# Altium project template.PrjPcb (part 3 of 3)
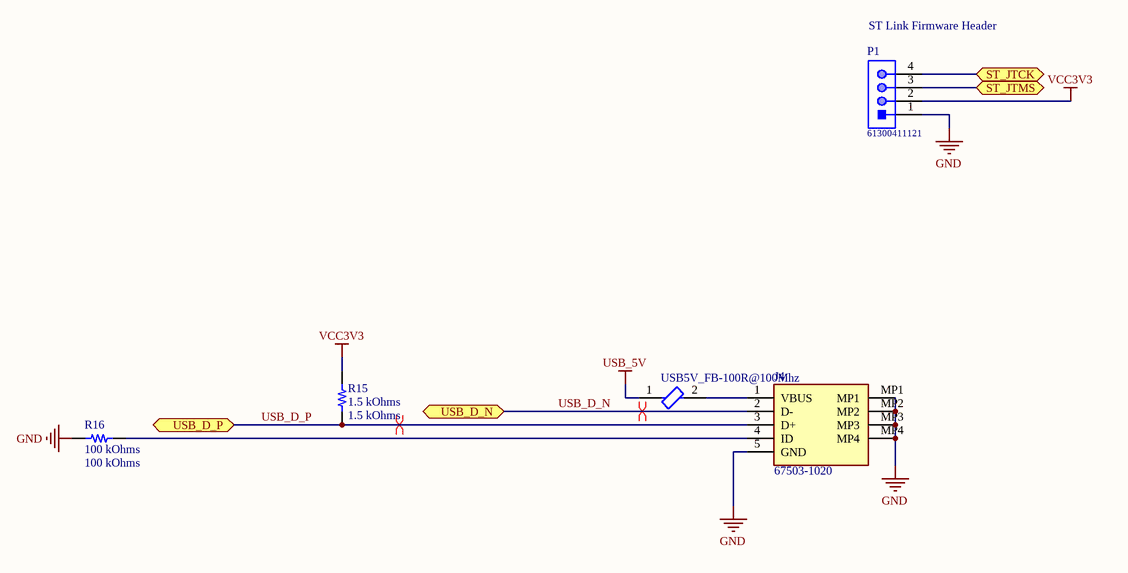
[diagram p19: DebuggerConnectors.SchDoc]

## Nets that join several sheets
GND: TOP (28 pins), STM32 (25 pins), Microcontroller/CAN1 (5 pins), Microcontroller/CAN2 (5 pins), 12V_POWER_BULKHEAD (6 pins), 12V Power And Ground/Shift Register (C9_12V_Power_And_Ground_Shift_Register.2 U2_12V_Power_And_Ground_Shift_Register.8 U2_12V_Power_And_Ground_Shift_Register.13), 12V Power And Ground/Designator (5 pins), 12V Power And Ground/Designator (5 pins), 12V Power And Ground/Designator (5 pins), 12V Power And Ground/Designator (5 pins), 12V Power And Ground/Designator (5 pins), 12V Power And Ground/Designator (5 pins), boardPower (8 pins), Buck (10 pins), LDO (5 pins), 12 Volt Signal Bulkhead/ (C3_6.1 R5_6.1), 12 Volt Signal Bulkhead/ (C3_5.1 R5_5.1), 12 Volt Signal Bulkhead/ (C3_4.1 R5_4.1), 12 Volt Signal Bulkhead/ (C3_3.1 R5_3.1), 12 Volt Signal Bulkhead/ (C3_2.1 R5_2.1), 12 Volt Signal Bulkhead/ (C3_1.1 R5_1.1), 5VBulkhead (6 pins), 5V Power And Ground/Shift Register (C9.2 U2.8 U2.13), 5V Power And Ground/5VLS1 (C7_5VLS1.1 C8_5VLS1.1 R13_5VLS1.1 U_5VLS1.4), 5V Power And Ground/5VLS2 (C7_5VLS2.1 C8_5VLS2.1 R13_5VLS2.1 U_5VLS2.4), 5V Power And Ground/5VLS3 (C7_5VLS3.1 C8_5VLS3.1 R13_5VLS3.1 U_5VLS3.4), 5V Power And Ground/5VLS4 (C7_5VLS4.1 C8_5VLS4.1 R13_5VLS4.1 U_5VLS4.4), 5V Power And Ground/5VLS5 (C7_5VLS5.1 C8_5VLS5.1 R13_5VLS5.1 U_5VLS5.4), 5V Power And Ground/5VLS6 (C7_5VLS6.1 C8_5VLS6.1 R13_5VLS6.1 U_5VLS6.4), Motor Controller 1 (DS1.2 DS2.2 P6_Motor_Controller_1.1), Motor Controller 1/Designator (5 pins), Motor Controller 2 (DS1_Motor_Controller_2.2 DS2_Motor_Controller_2.2 P6_Motor_Controller_2.1), Motor Controller 2/Designator (5 pins), Steering (DS1_Steering.2 DS2_Steering.2 P6_Steering.1), Steering/Designator (5 pins), DebuggerMCU (17 pins), DebuggerConnectors (7 pins)
VCC3V3: STM32 (18 pins), Microcontroller/CAN1 (C26_CAN1.2 U4_CAN1.5), Microcontroller/CAN2 (C26_CAN2.2 U4_CAN2.5), 12V Power And Ground/Designator (C6_12V_Power_And_Ground_Designator#1.2 R10_12V_Power_And_Ground_Designator#1.2 U1_12V_Power_And_Ground_Designator#1.3), 12V Power And Ground/Designator (C6_12V_Power_And_Ground_Designator#2.2 R10_12V_Power_And_Ground_Designator#2.2 U1_12V_Power_And_Ground_Designator#2.3), 12V Power And Ground/Designator (C6_12V_Power_And_Ground_Designator#3.2 R10_12V_Power_And_Ground_Designator#3.2 U1_12V_Power_And_Ground_Designator#3.3), 12V Power And Ground/Designator (C6_12V_Power_And_Ground_Designator#4.2 R10_12V_Power_And_Ground_Designator#4.2 U1_12V_Power_And_Ground_Designator#4.3), 12V Power And Ground/Designator (C6_12V_Power_And_Ground_Designator#5.2 R10_12V_Power_And_Ground_Designator#5.2 U1_12V_Power_And_Ground_Designator#5.3), 12V Power And Ground/Designator (C6_12V_Power_And_Ground_Designator#6.2 R10_12V_Power_And_Ground_Designator#6.2 U1_12V_Power_And_Ground_Designator#6.3), LDO (C20.2 C21.2 U5.2), 5V Power And Ground/5VLS1 (R12_5VLS1.2), 5V Power And Ground/5VLS2 (R12_5VLS2.2), 5V Power And Ground/5VLS3 (R12_5VLS3.2), 5V Power And Ground/5VLS4 (R12_5VLS4.2), 5V Power And Ground/5VLS5 (R12_5VLS5.2), 5V Power And Ground/5VLS6 (R12_5VLS6.2), Motor Controller 1/Designator (C6.2 R10.2 U1.3), Motor Controller 2/Designator (C6_Motor_Controller_2_Designator.2 R10_Motor_Controller_2_Designator.2 U1_Motor_Controller_2_Designator.3), Steering/Designator (C6_Steering_Designator.2 R10_Steering_Designator.2 U1_Steering_Designator.3), DebuggerMCU (6 pins), DebuggerConnectors (P1#2.2 R15#2.2)
VCC5V: Microcontroller/CAN1 (C38_CAN1.2 U4_CAN1.3), Microcontroller/CAN2 (C38_CAN2.2 U4_CAN2.3), 12V Power And Ground/Shift Register (C9_12V_Power_And_Ground_Shift_Register.1 U2_12V_Power_And_Ground_Shift_Register.10 U2_12V_Power_And_Ground_Shift_Register.16), boardPower (R34.2), Buck (5 pins), LDO (C18.2 C19.2 U5.3), 5V Power And Ground/Shift Register (C9.1 U2.10 U2.16), 5V Power And Ground/5VLS1 (C7_5VLS1.2 U_5VLS1.1 U_5VLS1.2), 5V Power And Ground/5VLS2 (C7_5VLS2.2 U_5VLS2.1 U_5VLS2.2), 5V Power And Ground/5VLS3 (C7_5VLS3.2 U_5VLS3.1 U_5VLS3.2), 5V Power And Ground/5VLS4 (C7_5VLS4.2 U_5VLS4.1 U_5VLS4.2), 5V Power And Ground/5VLS5 (C7_5VLS5.2 U_5VLS5.1 U_5VLS5.2), 5V Power And Ground/5VLS6 (C7_5VLS6.2 U_5VLS6.1 U_5VLS6.2)
VCC12V: 12V Power And Ground/Designator (C1_12V_Power_And_Ground_Designator#1.1 C4_12V_Power_And_Ground_Designator#1.1 U1_12V_Power_And_Ground_Designator#1.1 U1_12V_Power_And_Ground_Designator#1.9), 12V Power And Ground/Designator (C1_12V_Power_And_Ground_Designator#2.1 C4_12V_Power_And_Ground_Designator#2.1 U1_12V_Power_And_Ground_Designator#2.1 U1_12V_Power_And_Ground_Designator#2.9), 12V Power And Ground/Designator (C1_12V_Power_And_Ground_Designator#3.1 C4_12V_Power_And_Ground_Designator#3.1 U1_12V_Power_And_Ground_Designator#3.1 U1_12V_Power_And_Ground_Designator#3.9), 12V Power And Ground/Designator (C1_12V_Power_And_Ground_Designator#4.1 C4_12V_Power_And_Ground_Designator#4.1 U1_12V_Power_And_Ground_Designator#4.1 U1_12V_Power_And_Ground_Designator#4.9), 12V Power And Ground/Designator (C1_12V_Power_And_Ground_Designator#5.1 C4_12V_Power_And_Ground_Designator#5.1 U1_12V_Power_And_Ground_Designator#5.1 U1_12V_Power_And_Ground_Designator#5.9), 12V Power And Ground/Designator (C1_12V_Power_And_Ground_Designator#6.1 C4_12V_Power_And_Ground_Designator#6.1 U1_12V_Power_And_Ground_Designator#6.1 U1_12V_Power_And_Ground_Designator#6.9), boardPower (7 pins), Buck (6 pins), 5VBulkhead (R14.2), Motor Controller 1 (R7.2), Motor Controller 1/Designator (C1.1 C4_Motor_Controller_1_Designator.1 U1.1 U1.9), Motor Controller 2 (R7_Motor_Controller_2.2), Motor Controller 2/Designator (C1_Motor_Controller_2_Designator.1 C4_Motor_Controller_2_Designator.1 U1_Motor_Controller_2_Designator.1 U1_Motor_Controller_2_Designator.9), Steering (R7_Steering.2), Steering/Designator (C1_Steering_Designator.1 C4_Steering_Designator.1 U1_Steering_Designator.1 U1_Steering_Designator.9)
5V_CLOCK: STM32 (U6.1), 5V Power And Ground/Shift Register (U2.11)
5V_DATA: STM32 (U6.5), 5V Power And Ground/Shift Register (U2.14)
5V_FAULT: STM32 (U6.80), 5VBulkhead (R14.1), 5V Power And Ground/5VLS1 (U_5VLS1.8), 5V Power And Ground/5VLS2 (U_5VLS2.8), 5V Power And Ground/5VLS3 (U_5VLS3.8), 5V Power And Ground/5VLS4 (U_5VLS4.8), 5V Power And Ground/5VLS5 (U_5VLS5.8), 5V Power And Ground/5VLS6 (U_5VLS6.8)
5V_LATCH: STM32 (U6.3), 5V Power And Ground/Shift Register (U2.12)
12-3_1: STM32 (U6.15), 12 Volt Signal Bulkhead/ (C3_6.2 R4_6.1 R5_6.2)
12-3_2: STM32 (U6.16), 12 Volt Signal Bulkhead/ (C3_5.2 R4_5.1 R5_5.2)
12-3_3: STM32 (U6.36), 12 Volt Signal Bulkhead/ (C3_4.2 R4_4.1 R5_4.2)
12-3_4: STM32 (U6.18), 12 Volt Signal Bulkhead/ (C3_3.2 R4_3.1 R5_3.2)
12-3_5: STM32 (U6.26), 12 Volt Signal Bulkhead/ (C3_2.2 R4_2.1 R5_2.2)
12-3_6: STM32 (U6.25), 12 Volt Signal Bulkhead/ (C3_1.2 R4_1.1 R5_1.2)
12V_CLOCK: STM32 (U6.78), 12V Power And Ground/Shift Register (U2_12V_Power_And_Ground_Shift_Register.11)
12V_DATA: STM32 (U6.35), 12V Power And Ground/Shift Register (U2_12V_Power_And_Ground_Shift_Register.14)
12V_LATCH: STM32 (U6.77), 12V Power And Ground/Shift Register (U2_12V_Power_And_Ground_Shift_Register.12)
CAN1_N: Microcontroller/CAN1 (R20_CAN1.1 U4_CAN1.6), Connectors (P?#5.1)
CAN1_P: Microcontroller/CAN1 (SW1_CAN1.1 U4_CAN1.7), Connectors (P?#5.2)
CAN1_RX: STM32 (U6.70), Microcontroller/CAN1 (U4_CAN1.4)
CAN1_STBY: STM32 (U6.69), Microcontroller/CAN1 (U4_CAN1.8)
CAN1_TX: STM32 (U6.71), Microcontroller/CAN1 (U4_CAN1.1)
CAN2_N: Microcontroller/CAN2 (R20_CAN2.1 U4_CAN2.6), Connectors (P?#6.1)
CAN2_P: Microcontroller/CAN2 (SW1_CAN2.1 U4_CAN2.7), Connectors (P?#6.2)
CAN2_RX: STM32 (U6.51), Microcontroller/CAN2 (U4_CAN2.4)
CAN2_STBY: STM32 (U6.53), Microcontroller/CAN2 (U4_CAN2.8)
CAN2_TX: STM32 (U6.52), Microcontroller/CAN2 (U4_CAN2.1)
MC1_ENABLE: STM32 (U6.44), Motor Controller 1/Designator (U1.2)
MC2_ENABLE: STM32 (U6.45), Motor Controller 2/Designator (U1_Motor_Controller_2_Designator.2)
Net12V_SIG_1: 12V_SIGNAL_BULKHEAD (12V_SIG.1), 12 Volt Signal Bulkhead/ (R4_1.2)
Net12V_SIG_2: 12V_SIGNAL_BULKHEAD (12V_SIG.2), 12 Volt Signal Bulkhead/ (R4_2.2)
Net12V_SIG_3: 12V_SIGNAL_BULKHEAD (12V_SIG.3), 12 Volt Signal Bulkhead/ (R4_3.2)
Net12V_SIG_4: 12V_SIGNAL_BULKHEAD (12V_SIG.4), 12 Volt Signal Bulkhead/ (R4_4.2)
Net12V_SIG_5: 12V_SIGNAL_BULKHEAD (12V_SIG.5), 12 Volt Signal Bulkhead/ (R4_5.2)
Net12V_SIG_6: 12V_SIGNAL_BULKHEAD (12V_SIG.6), 12 Volt Signal Bulkhead/ (R4_6.2)
NetC5_12V_Power_And_Ground_Designator#1_2: 12V_POWER_BULKHEAD (P?#1.6), 12V Power And Ground/Designator (C5_12V_Power_And_Ground_Designator#1.2 R11_12V_Power_And_Ground_Designator#1.1 U1_12V_Power_And_Ground_Designator#1.8)
NetC5_12V_Power_And_Ground_Designator#2_2: 12V_POWER_BULKHEAD (P?#1.5), 12V Power And Ground/Designator (C5_12V_Power_And_Ground_Designator#2.2 R11_12V_Power_And_Ground_Designator#2.1 U1_12V_Power_And_Ground_Designator#2.8)
NetC5_12V_Power_And_Ground_Designator#3_2: 12V_POWER_BULKHEAD (P?#1.4), 12V Power And Ground/Designator (C5_12V_Power_And_Ground_Designator#3.2 R11_12V_Power_And_Ground_Designator#3.1 U1_12V_Power_And_Ground_Designator#3.8)
NetC5_12V_Power_And_Ground_Designator#4_2: 12V_POWER_BULKHEAD (P?#1.3), 12V Power And Ground/Designator (C5_12V_Power_And_Ground_Designator#4.2 R11_12V_Power_And_Ground_Designator#4.1 U1_12V_Power_And_Ground_Designator#4.8)
NetC5_12V_Power_And_Ground_Designator#5_2: 12V_POWER_BULKHEAD (P?#1.2), 12V Power And Ground/Designator (C5_12V_Power_And_Ground_Designator#5.2 R11_12V_Power_And_Ground_Designator#5.1 U1_12V_Power_And_Ground_Designator#5.8)
NetC5_12V_Power_And_Ground_Designator#6_2: 12V_POWER_BULKHEAD (P?#1.1), 12V Power And Ground/Designator (C5_12V_Power_And_Ground_Designator#6.2 R11_12V_Power_And_Ground_Designator#6.1 U1_12V_Power_And_Ground_Designator#6.8)
NetC5_Motor_Controller_1_Designator_2: Motor Controller 1 (P6_Motor_Controller_1.2 R6.2), Motor Controller 1/Designator (C5_Motor_Controller_1_Designator.2 R11.1 U1.8)
NetC5_Motor_Controller_2_Designator_2: Motor Controller 2 (P6_Motor_Controller_2.2 R6_Motor_Controller_2.2), Motor Controller 2/Designator (C5_Motor_Controller_2_Designator.2 R11_Motor_Controller_2_Designator.1 U1_Motor_Controller_2_Designator.8)
NetC5_Steering_Designator_2: Steering (P6_Steering.2 R6_Steering.2), Steering/Designator (C5_Steering_Designator.2 R11_Steering_Designator.1 U1_Steering_Designator.8)
NetC8_5VLS1_2: 5VBulkhead (P7.6), 5V Power And Ground/5VLS1 (C8_5VLS1.2 U_5VLS1.6)
NetC8_5VLS2_2: 5VBulkhead (P7.5), 5V Power And Ground/5VLS2 (C8_5VLS2.2 U_5VLS2.6)
NetC8_5VLS3_2: 5VBulkhead (P7.4), 5V Power And Ground/5VLS3 (C8_5VLS3.2 U_5VLS3.6)
NetC8_5VLS4_2: 5VBulkhead (P7.3), 5V Power And Ground/5VLS4 (C8_5VLS4.2 U_5VLS4.6)
NetC8_5VLS5_2: 5VBulkhead (P7.2), 5V Power And Ground/5VLS5 (C8_5VLS5.2 U_5VLS5.6)
NetC8_5VLS6_2: 5VBulkhead (P7.1), 5V Power And Ground/5VLS6 (C8_5VLS6.2 U_5VLS6.6)
NetP1#1_1: TOP (P1#1.1), STM32 (U6.23)
NetP1#1_2: TOP (P1#1.2), STM32 (U6.24)
NetP2_1: TOP (P2.1), STM32 (U6.38)
NetP2_2: TOP (P2.2), STM32 (U6.39)
NetP2_3: TOP (P2.3), STM32 (U6.65)
NetP2_4: TOP (P2.4), STM32 (U6.66)
NetP5_1: TOP (P5.1), STM32 (U6.86)
NetP5_2: TOP (P5.2), STM32 (U6.87)
NetR12_5VLS1_1: 5V Power And Ground/Shift Register (U2.15), 5V Power And Ground/5VLS1 (R12_5VLS1.1 U_5VLS1.3)
NetR12_5VLS2_1: 5V Power And Ground/Shift Register (U2.1), 5V Power And Ground/5VLS2 (R12_5VLS2.1 U_5VLS2.3)
NetR12_5VLS3_1: 5V Power And Ground/Shift Register (U2.2), 5V Power And Ground/5VLS3 (R12_5VLS3.1 U_5VLS3.3)
NetR12_5VLS4_1: 5V Power And Ground/Shift Register (U2.3), 5V Power And Ground/5VLS4 (R12_5VLS4.1 U_5VLS4.3)
NetR12_5VLS5_1: 5V Power And Ground/Shift Register (U2.4), 5V Power And Ground/5VLS5 (R12_5VLS5.1 U_5VLS5.3)
NetR12_5VLS6_1: 5V Power And Ground/Shift Register (U2.5), 5V Power And Ground/5VLS6 (R12_5VLS6.1 U_5VLS6.3)
NetR25_2: TOP (R25.2 STLINK-HEADER-1.2), STM32 (U6.72)
NetR26_2: TOP (R26.2 STLINK-HEADER-1.1), STM32 (U6.76)
NetR54_2: TOP (R54.2), STM32 (U6.93)
NetR55_2: TOP (R55.2), STM32 (U6.92)
NetU1_12V_Power_And_Ground_Designator#1_2: 12V Power And Ground/Shift Register (U2_12V_Power_And_Ground_Shift_Register.15), 12V Power And Ground/Designator (U1_12V_Power_And_Ground_Designator#1.2)
NetU1_12V_Power_And_Ground_Designator#2_2: 12V Power And Ground/Shift Register (U2_12V_Power_And_Ground_Shift_Register.1), 12V Power And Ground/Designator (U1_12V_Power_And_Ground_Designator#2.2)
NetU1_12V_Power_And_Ground_Designator#3_2: 12V Power And Ground/Shift Register (U2_12V_Power_And_Ground_Shift_Register.2), 12V Power And Ground/Designator (U1_12V_Power_And_Ground_Designator#3.2)
NetU1_12V_Power_And_Ground_Designator#4_2: 12V Power And Ground/Shift Register (U2_12V_Power_And_Ground_Shift_Register.3), 12V Power And Ground/Designator (U1_12V_Power_And_Ground_Designator#4.2)
NetU1_12V_Power_And_Ground_Designator#5_2: 12V Power And Ground/Shift Register (U2_12V_Power_And_Ground_Shift_Register.4), 12V Power And Ground/Designator (U1_12V_Power_And_Ground_Designator#5.2)
NetU1_12V_Power_And_Ground_Designator#6_2: 12V Power And Ground/Shift Register (U2_12V_Power_And_Ground_Shift_Register.5), 12V Power And Ground/Designator (U1_12V_Power_And_Ground_Designator#6.2)
ST_JTCK: DebuggerMCU (U.37), DebuggerConnectors (P1#2.4)
ST_JTMS: DebuggerMCU (U.34), DebuggerConnectors (P1#2.3)
STEERING_ENABLE: STM32 (U6.46), Steering/Designator (U1_Steering_Designator.2)
USB_D_N: DebuggerMCU (U.32), DebuggerConnectors (J4.2)
USB_D_P: DebuggerMCU (U.33), DebuggerConnectors (J4.3 R15#2.1)